# EAGLE schematic DisplayController (EAGLE 9.2.2)

## Sheet 1 of 3: Microcontroller
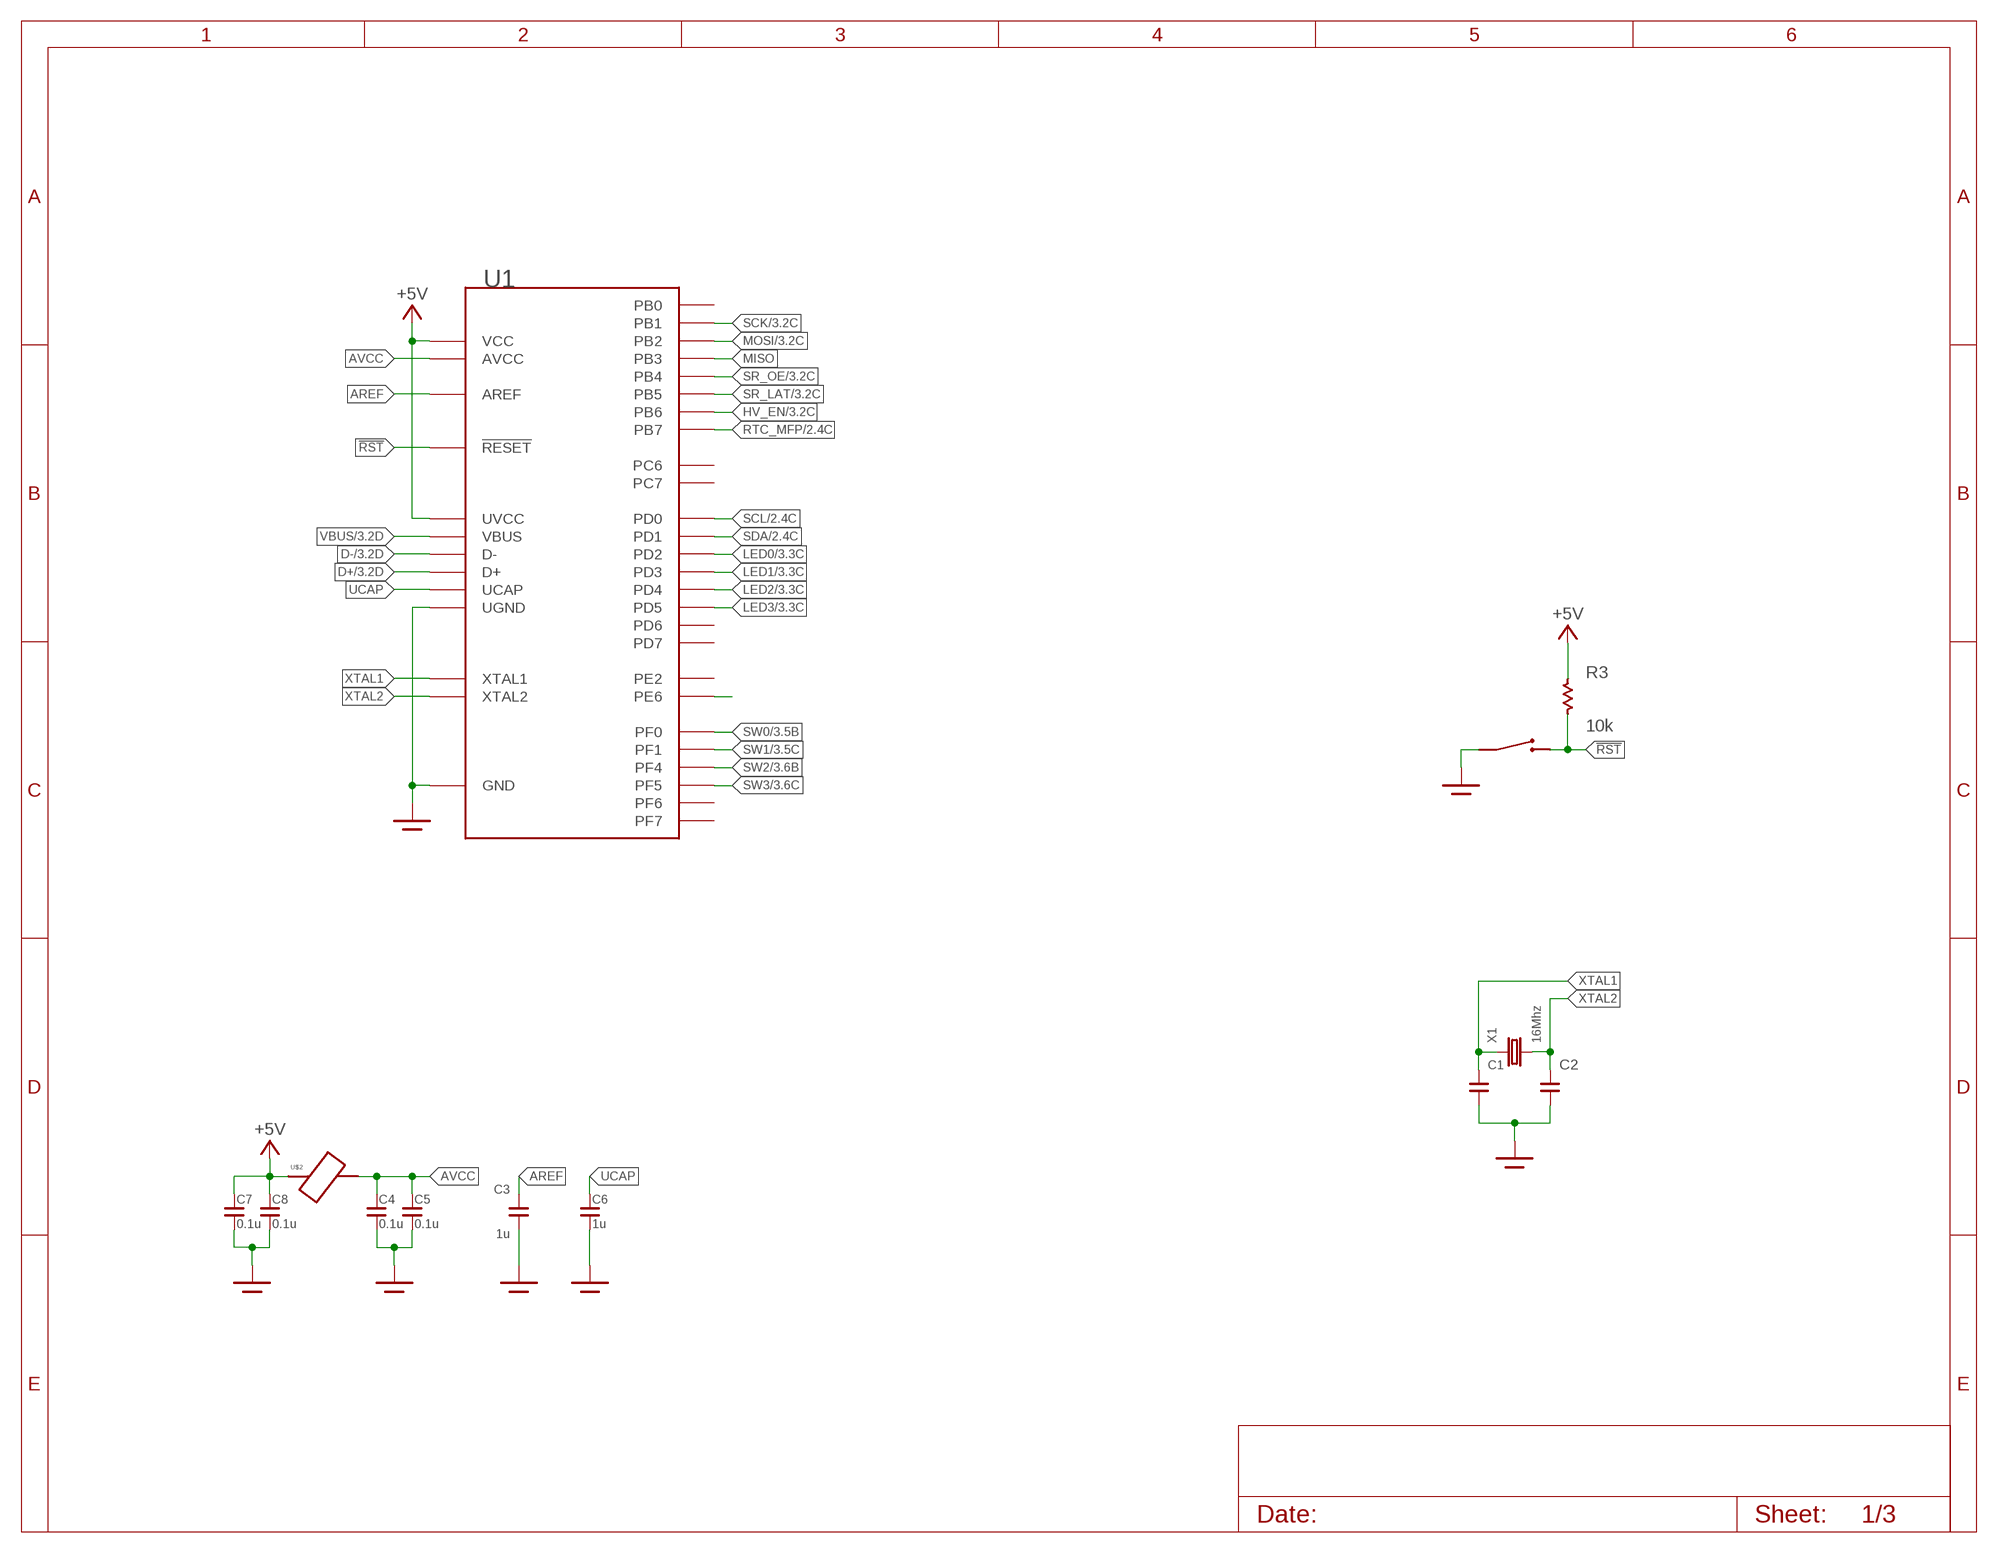
[diagram p0: schematic, sheet 1]

### Parts
C1  CAP-CERAMIC0805  [SMD-805]
C2  CAP-CERAMIC0805  [SMD-805]
C3  1u  CAP-CERAMIC0805  [SMD-805]
C4  0.1u  CAP-CERAMIC0805  [SMD-805]
C5  0.1u  CAP-CERAMIC0805  [SMD-805]
C6  1u  CAP-CERAMIC0805  [SMD-805]
C7  0.1u  CAP-CERAMIC0805  [SMD-805]
C8  0.1u  CAP-CERAMIC0805  [SMD-805]
R3  10k  RESISTOR0805  [SMD-805]
U1  AMEGA32U4"  [TQFP44]
U$1  SWITCH-SPST  [PTS645SL50SMTR92LFS]
U$2  FERRITE  [SMD-1206]
X1  16Mhz  CRYSTAL  [CRYSTAL-3.2-2.5]

### Nets
!RST: R3.2 U1.13(!RESET) U$1.P$3 U$1.P$4
+5V: C7.1 C8.1 R3.1 U1.2(UVCC) U1.14(VCC) U1.34(VCC) U$2.1 ; also sheet 2,3
AREF: C3.1 U1.42(AREF)
AVCC: C4.1 C5.1 U1.24(AVCC) U1.44(AVCC) U$2.2
D+: U1.4(D+) ; also sheet 3
D-: U1.3(D-) ; also sheet 3
GND: C1.2 C2.2 C3.2 C4.2 C5.2 C6.2 C7.2 C8.2 U1.5(UGND) U1.15(GND) U1.23(GND) U1.35(GND) U1.43(GND) U$1.P$1 U$1.P$2 ; also sheet 2,3
HV_EN: U1.30(PB6) ; also sheet 3
LED0: U1.20(PD2) ; also sheet 3
LED1: U1.21(PD3) ; also sheet 3
LED2: U1.25(PD4) ; also sheet 3
LED3: U1.22(PD5) ; also sheet 3
MISO: U1.11(PB3)
MOSI: U1.10(PB2) ; also sheet 3
N$14: U1.1(PE6)
RTC_MFP: U1.12(PB7) ; also sheet 2
SCK: U1.9(PB1) ; also sheet 3
SCL: U1.18(PD0) ; also sheet 2
SDA: U1.19(PD1) ; also sheet 2
SR_LAT: U1.29(PB5) ; also sheet 3
SR_OE: U1.28(PB4) ; also sheet 3
SW0: U1.41(PF0) ; also sheet 3
SW1: U1.40(PF1) ; also sheet 3
SW2: U1.39(PF4) ; also sheet 3
SW3: U1.38(PF5) ; also sheet 3
UCAP: C6.1 U1.6(UCAP)
VBUS: U1.7(VBUS) ; also sheet 3
XTAL1: C1.1 U1.17(XTAL1) X1.1
XTAL2: C2.1 U1.16(XTAL2) X1.3
Unconnected: U1.8(PB0) U1.26(PD6) U1.27(PD7) U1.31(PC6) U1.32(PC7) U1.33(PE2) U1.36(PF7) U1.37(PF6)

## Sheet 2 of 3: RTC and Others
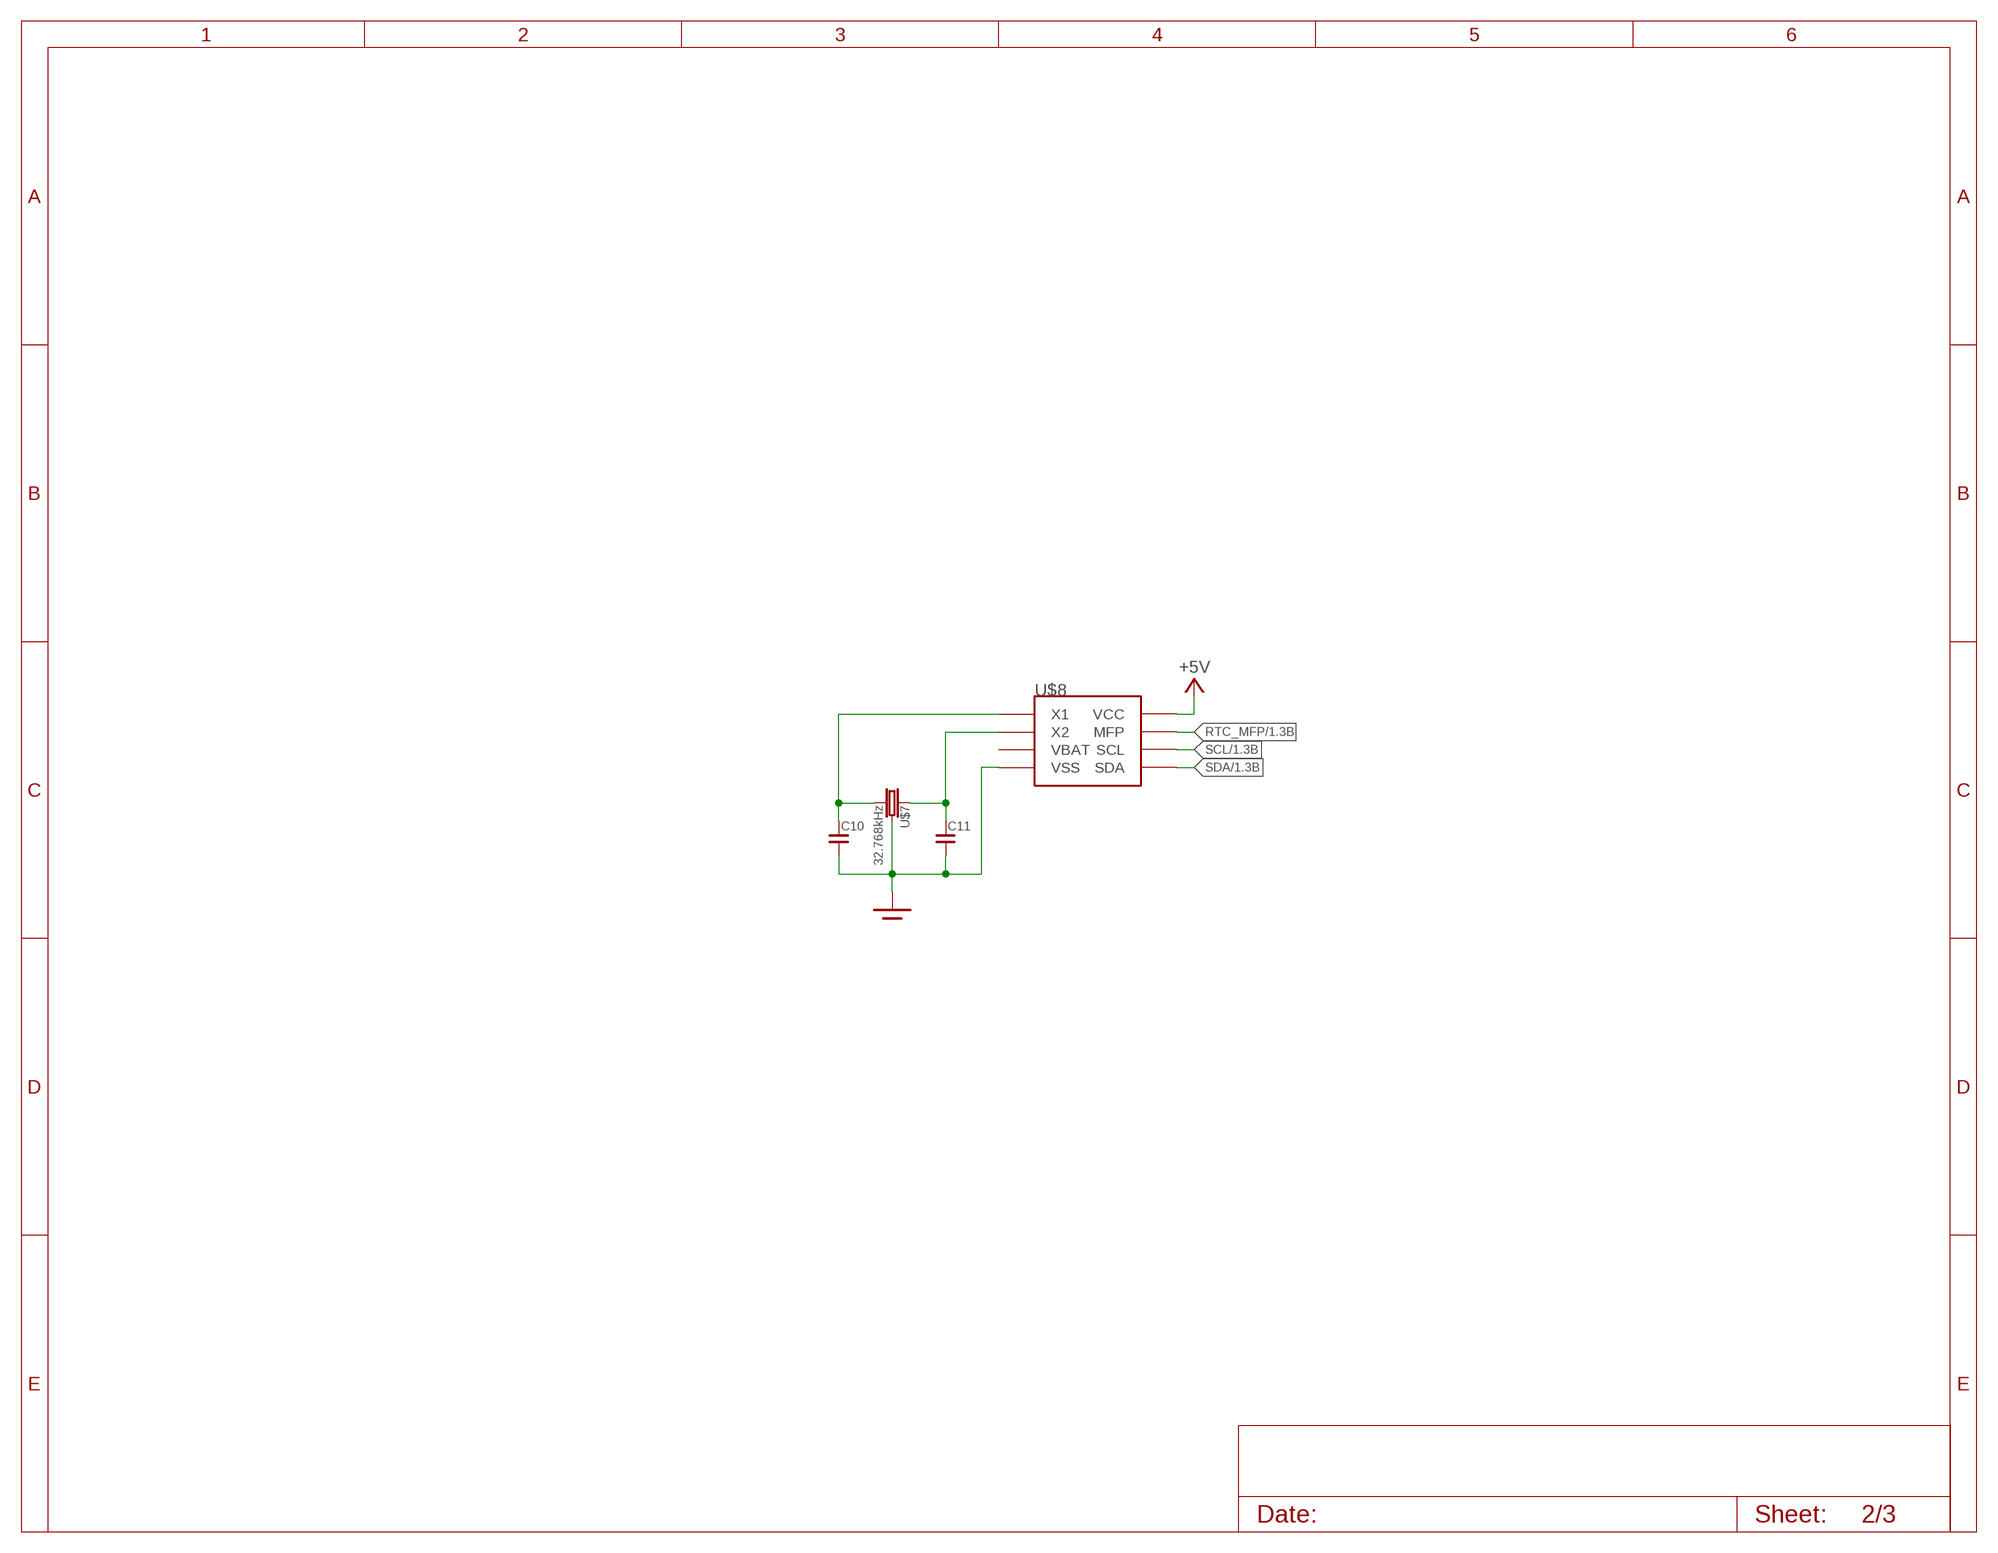
[diagram p1: schematic, sheet 2]

### Parts
C10  CAP-CERAMIC0805  [SMD-805]
C11  CAP-CERAMIC0805  [SMD-805]
U$7  32.768kHz  TUNING_FORK  [ABS25]
U$8  MCP7940N  [SO-8N]

### Nets
+5V: U$8.8(VCC) ; also sheet 1,3
GND: C10.2 C11.2 U$7.2 U$7.3 U$8.4(VSS) ; also sheet 1,3
N$6: C10.1 U$7.4 U$8.1(X1)
N$7: C11.1 U$7.1 U$8.2(X2)
RTC_MFP: U$8.7(MFP) ; also sheet 1
SCL: U$8.6(SCL) ; also sheet 1
SDA: U$8.5(SDA) ; also sheet 1
Unconnected: U$8.3(VBAT)

## Sheet 3 of 3: Regulation and I/O
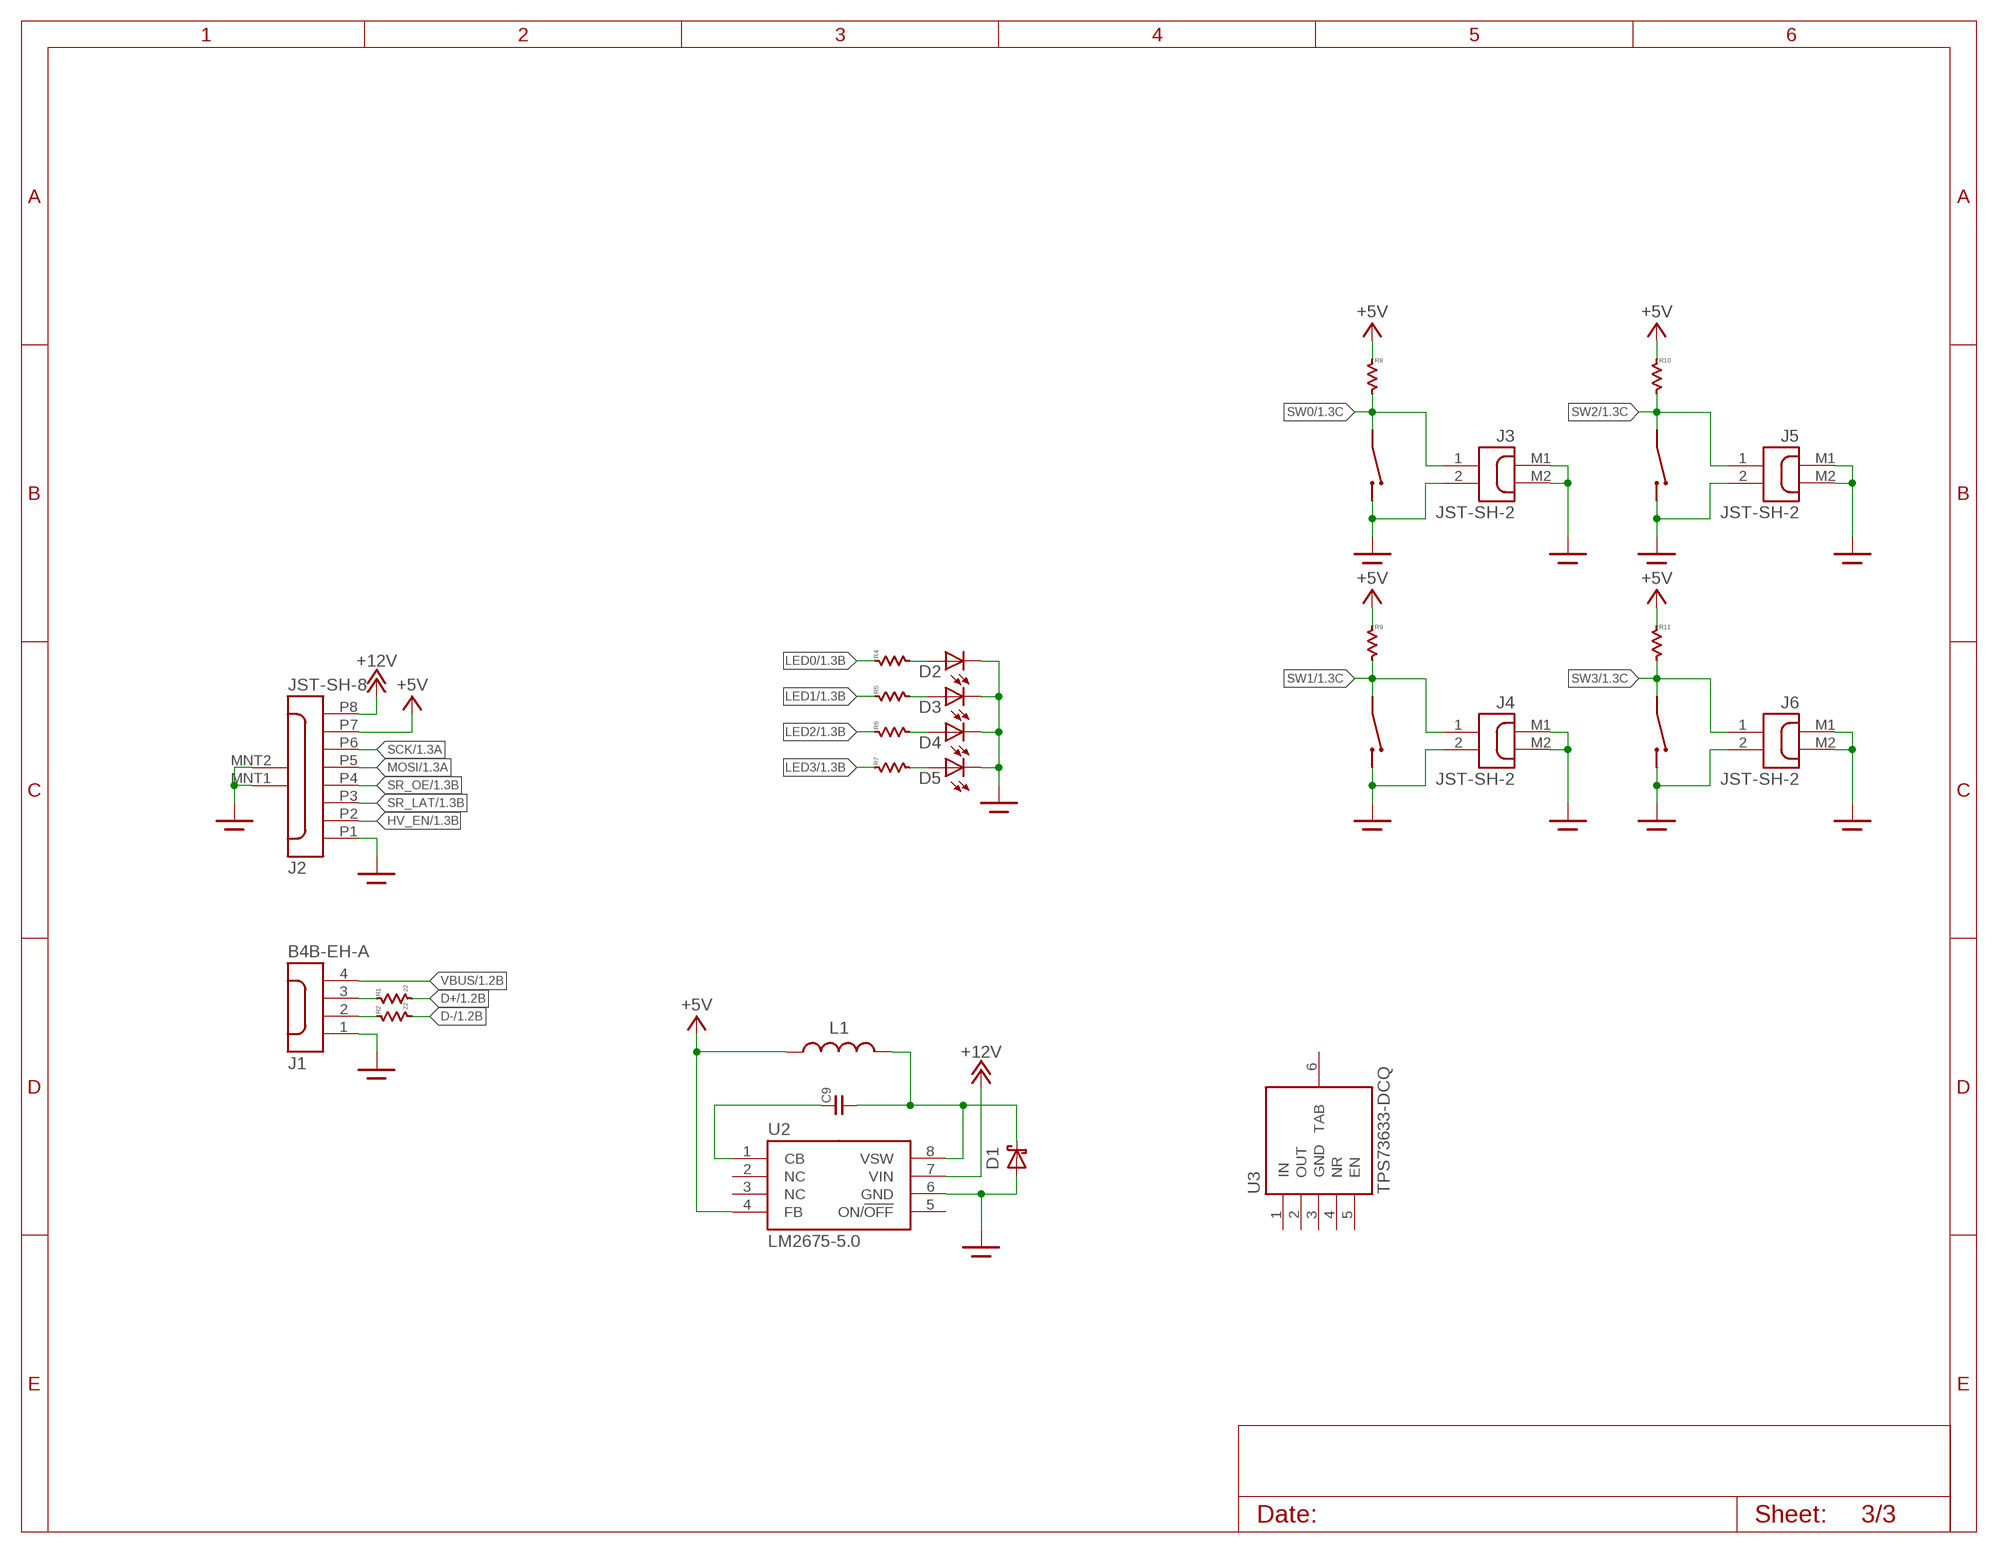
[diagram p2: schematic, sheet 3]

### Parts
C9  CAP-CERAMIC0805  [SMD-805]
D1  DIODE-SCHOTTKY-DO-214AC  [DO-214AC]
D2  LTST-C150GKT  [1206-LED]
D3  LTST-C150GKT  [1206-LED]
D4  LTST-C150GKT  [1206-LED]
D5  LTST-C150GKT  [1206-LED]
J1  B4B-EH-A  [B4B-EH-A]
J2  JST-SH-8  [JST-SH-8]
J3  JST-SH-2  [JST-SH-2]
J4  JST-SH-2  [JST-SH-2]
J5  JST-SH-2  [JST-SH-2]
J6  JST-SH-2  [JST-SH-2]
L1  INDUCTOR-7447779168  [7447779168]
R1  22  RESISTOR0805  [SMD-805]
R2  22  RESISTOR0805  [SMD-805]
R4  RESISTOR0805  [SMD-805]
R5  RESISTOR0805  [SMD-805]
R6  RESISTOR0805  [SMD-805]
R7  RESISTOR0805  [SMD-805]
R8  RESISTOR0805  [SMD-805]
R9  RESISTOR0805  [SMD-805]
R10  RESISTOR0805  [SMD-805]
R11  RESISTOR0805  [SMD-805]
U2  LM2675-5.0  [SO-8N]
U3  TPS73633-DCQ  [SOT223-6]
U$3  SWITCH-SPST  [PTS645SL50SMTR92LFS]
U$4  SWITCH-SPST  [PTS645SL50SMTR92LFS]
U$5  SWITCH-SPST  [PTS645SL50SMTR92LFS]
U$6  SWITCH-SPST  [PTS645SL50SMTR92LFS]

### Nets
+5V: J2.P7 L1.1 R8.1 R9.1 R10.1 R11.1 U2.4(FB) ; also sheet 1,2
+12V: J2.P8 U2.7(VIN)
D+: R1.2 ; also sheet 1
D-: R2.2 ; also sheet 1
GND: D1.AN(A) D2.CATH(C) D3.CATH(C) D4.CATH(C) D5.CATH(C) J1.1 J2.MNT1 J2.MNT2 J2.P1 J3.2 J3.M1 J3.M2 J4.2 J4.M1 J4.M2 J5.2 J5.M1 J5.M2 J6.2 J6.M1 J6.M2 U2.6(GND) U$3.P$3 U$3.P$4 U$4.P$3 U$4.P$4 U$5.P$3 U$5.P$4 U$6.P$3 U$6.P$4 ; also sheet 1,2
HV_EN: J2.P2 ; also sheet 1
LED0: R4.1 ; also sheet 1
LED1: R5.1 ; also sheet 1
LED2: R6.1 ; also sheet 1
LED3: R7.1 ; also sheet 1
MOSI: J2.P5 ; also sheet 1
N$1: J1.3 R1.1
N$2: J1.2 R2.1
N$3: D2.AN(A) R4.2
N$4: C9.2 D1.CATH(C) L1.2 U2.8(VSW)
N$5: C9.1 U2.1(CB)
N$8: D3.AN(A) R5.2
N$10: D4.AN(A) R6.2
N$12: D5.AN(A) R7.2
SCK: J2.P6 ; also sheet 1
SR_LAT: J2.P3 ; also sheet 1
SR_OE: J2.P4 ; also sheet 1
SW0: J3.1 R8.2 U$3.P$1 U$3.P$2 ; also sheet 1
SW1: J4.1 R9.2 U$4.P$1 U$4.P$2 ; also sheet 1
SW2: J5.1 R10.2 U$5.P$1 U$5.P$2 ; also sheet 1
SW3: J6.1 R11.2 U$6.P$1 U$6.P$2 ; also sheet 1
VBUS: J1.4 ; also sheet 1
Unconnected: U2.2(NC) U2.3(NC) U2.5(ON/!OFF) U3.4(NR) U3.5(EN)

## Power pins joined to a net without a drawn wire
GND: U3.3(GND)
IN: U3.1(IN)
OUT: U3.2(OUT)
TAB: U3.6(TAB)

## Library data of the parts
C1-C11 = NixieDisplay:CAP-CERAMIC
D1 = NixieDisplay:DIODE-SCHOTTKY: Diode - Schottky
D2-D5 = NixieDisplay:LTST-C150GKT
J1 = NixieDisplay:B4B-EH-A
J2 = NixieDisplay:JST-SH-8
J3-J6 = NixieDisplay:JST-SH-2
L1 = NixieDisplay:INDUCTOR: Surface Mount Inductor
R1-R11 = NixieDisplay:RESISTOR
U1 = NixieDisplay:AMEGA32U4: 8 bit 16Mhz uC with USB
U2 = NixieDisplay:LM2675-5.0: 5v 500mA Step Down Switching Regulator
U3 = NixieDisplay:TPS73633-DCQ: 400mA 3.3v Linear Regulator
U$1 U$3-U$6 = NixieDisplay:SWITCH-SPST
U$2 = NixieDisplay:FERRITE
U$7 = NixieDisplay:TUNING_FORK
U$8 = NixieDisplay:MCP7940N: RTC with I2C
X1 = NixieDisplay:CRYSTAL